# Altium schematic sheet txrx_switch.SchDoc
size Letter; SheetNumber: 8; SheetTotal: 9
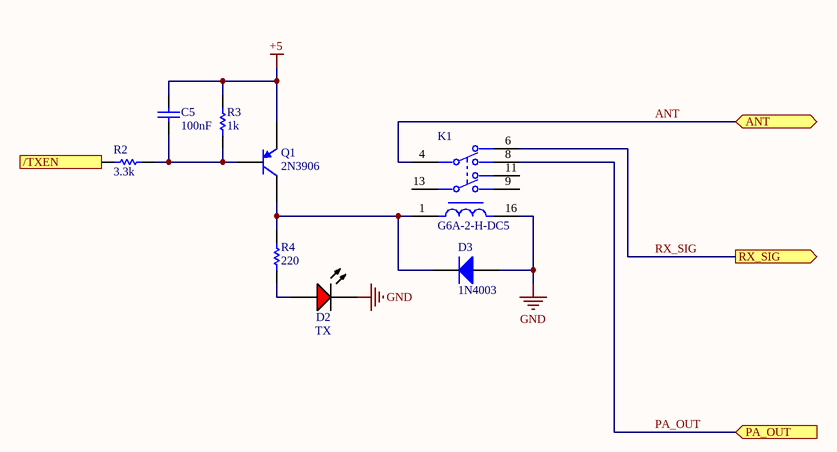
[diagram p0: txrx_switch.SchDoc]

## Parts
C5  value 100nF  [RAD-0.1]  (hidden comment: Cap)
D2  TX  [AVAG-HLMP-3301-2]
D3  1N4003  [DIOD-DO-41-P-2_V]
K1  G6A-2-H-DC5  [FP-G6A-2-H-DC5-MFG]
Q1  2N3906  [TO-92A]
R2  value 3.3k  [AXIAL-0.4]  (hidden comment: Res1)
R3  value 1k  [AXIAL-0.4]  (hidden comment: Res1)
R4  value 220  [AXIAL-0.4]  (hidden comment: Res1)

## Ports
/TXEN (in), ANT (bidir), PA_OUT (in), RX_SIG (out)

## Nets
+5: C5.1 Q1.1(E) R3.2
GND: D2.1(K) D3.1(A) K1.16
/TXEN: R2.1 ; port /TXEN
ANT: K1.4 ; port ANT
PA_OUT: K1.8 ; port PA_OUT
RX_SIG: K1.6 ; port RX_SIG
NetC5_2: C5.2 Q1.2(B) R2.2 R3.1
NetD2_2: D2.2(A) R4.1
NetD3_2: D3.2(K) K1.1 Q1.3(C) R4.2

Not connected (* = marked no-connect by the designer): K1 9 11 13

## Library data of the parts
C5 = Cap: Capacitor; Published: 8-Jun-2000; LatestRevisionDate: 17-Jul-2002; LatestRevisionNote: Re-released for DXP Platform.; PackageReference: RAD-0.3; Publisher: Altium Limited; PackageDescription: Radial Cap, Thru-Hole; 2 Leads; 0.3 in Pin Spacing
D2 = CMP-2000-06411-1: T-1 3/4 (5 mm) Diffused LED Lamp, 1.9 V, -40 to 100 degC, 2-Pin THD, RoHS, Bulk; Manufacturer: Avago; Forward Current: 25mA; Forward Voltage: 2.4V; Peak Wavelength: 635nm; Shape Type: Circular; High Brightness: No; Main Category: StandardLED; Test Current (It): 10mA; Dominant Wave Length: 626nm; Number of  Elements: 1; Reverse Voltage: 5V; Chip Material: GaP; Product Height (mm): 9.19mm; Lens Type: ColoredDiffused; Viewing Angle: 60deg; Type: Uni-Color; Emitting Color: Red; Luminous Intensity: 5.4mcd; Power Dissipation: 85W; DELETED: Compliant; Product Depth (mm): 6.1mm; Package Description: 2-Pin Through Hole LED, Dia 5.85 mm; Mounting Technology: ThroughHole; Manufacturer URL: http://www.avagotech.com/; Package Type: T-13/4; Operating Temp Range: -40Cto100C; Datasheet URL: http://www.avagotech.com/docs/AV02-1558EN; Mounting: ThroughHole; Lens Dimensions: 5.08x5.08x8.3mm; Package Reference: HLMP-3301; Datasheet Version: 03/2015; Pin Count: 2; Packaging: TapeandReel; Operating Temperature Classification: Industrial; Lum Intensity: 5.4mcd; Rad Hardened: No; Product Length (mm): 6.1mm
D3 = CMP-0639-00004-2: 1.0 A Rectifier, 15 pF, 200 V, -65 to 150 degC, 2-Pin DO-41 Plastic, RoHS, Tape and Reel; PartNumber: 1N4003-T; Manufacturer: Diodes Inc; CT (pF): 15; Max. IR (uA): 5; Max. Average Rectified Current IO (A): 1; VRRM (V): 200; Max. IFSM (A): 30; Packing: Tape and Reel; PackageDescription: 2-Pin Axial Lead, Body 4.635 x 2.36 mm, Lead Spread 25.4 mm; Mounting Technology: Through Hole; ComponentLink2Description: Datasheet; RoHS: TRUE; DatasheetVersion: Rev. 8-2; ComponentLink1URL: http://diodes.com/; PackageReference: DO-41-P-2; ComponentLink2URL: http://diodes.com/datasheets/ds28002.pdf; VF (V): 1; ComponentLink1Description: Manufacturer URL; Operating Temperature Range (degC): -65 to 150
K1 = CMP-08823-000040-1: RELAY GEN PURPOSE DPDT 2A 5VDC; Power Consumption: 200mW; Coil Type: Non-Latching; Relay Type: General Purpose; Coil Voltage (DC): 5V; Series: G6A; Coil Current: 2A; Packaging: Bulk; Termination: PC Pin; Mount: Through Hole; Throw Configuration: DPDT; Package Quantity: 25
Q1 = 2N3906: PNP General Purpose Amplifier; Published: 8-Jun-2000; LatestRevisionDate: 15-Jan-2003; LatestRevisionNote: PCB Footprint 'BCY-W3/D4.7' replaced; DatasheetVersion: 1997; PackageVersion: Sep-1998; PackageReference: TO-92A; Publisher: Altium Limited; PackageDescription: TO, Flat Index; 3 In-Line, Axial Leads; Body Dia. 4.5mm; Leads 0.51 x 0.48 mm (max); ComponentLink1Description: Manufacturer Link; ComponentLink1URL: http://www.fairchildsemi.com/; ComponentLink2Description: Datasheet; ComponentLink2URL: http://www.fairchildsemi.com/ds/2N%2F2N3906.pdf
R2-R4 = Res1: Resistor; Published: 8-Jun-2000; LatestRevisionDate: 17-Jul-2002; LatestRevisionNote: Re-released for DXP Platform.; PackageReference: AXIAL-0.3; Publisher: Altium Limited; PackageDescription: Axial Device, Thru-Hole; 2 Leads; 0.3 in Pin Spacing